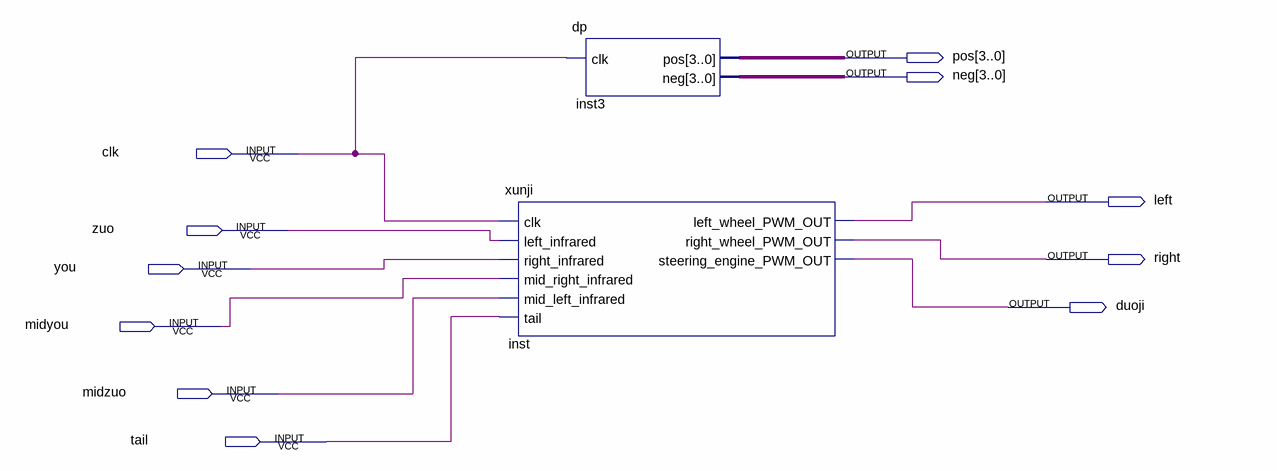
[diagram p0: schematic sheet]
// Quartus schematic Block1.bdf as structural Verilog: 2 symbols, 11 pins
module Block1 (
  input  clk,
  input  zuo,
  input  you,
  input  midyou,
  input  midzuo,
  input  tail,
  output [3:0] pos,
  output [3:0] neg,
  output left,
  output right,
  output duoji
);

  xunji inst (
    .clk(clk), .left_infrared(zuo), .right_infrared(you), .mid_right_infrared(midyou),
    .mid_left_infrared(midzuo), .tail(tail), .left_wheel_PWM_OUT(left), .right_wheel_PWM_OUT(right),
    .steering_engine_PWM_OUT(duoji));
  dp inst3 (.clk(clk), .pos(pos), .neg(neg));
endmodule
